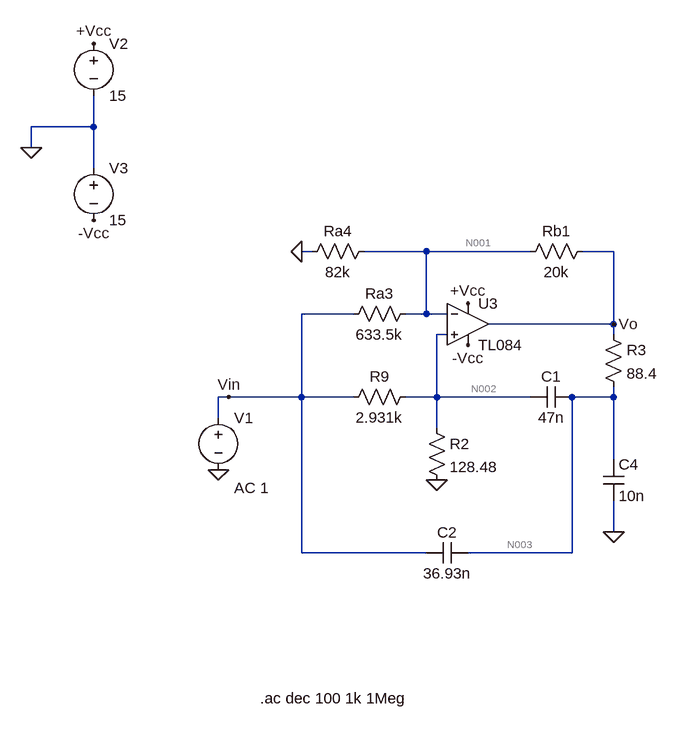
[diagram p0: schematic Sedra_etapa1.asc]
* Sedra_etapa1.asc
V1 Vin 0 AC 1
V2 +Vcc 0 15
V3 0 -Vcc 15
R9 N002 Vin 2.931k
Ra3 N001 Vin 633.5k
R2 N002 0 128.48
C1 N003 N002 47n
C2 N003 Vin 36.93n
Ra4 N001 0 82k
Rb1 Vo N001 20k
C4 N003 0 10n
R3 Vo N003 88.4
* U3: TL084 (symbol sympropio\TL084 not available, pins judged from their places): In+=N002 In-=N001 V+=+Vcc V-=-Vcc OUT=Vo
.ac dec 100 1k 1Meg
.backanno
.end

* Results of the author's LTspice run, read from the files saved beside the schematic
* Operating Point, zero values left out:
*   V(+vcc) = 15 V
*   V(-vcc) = -15 V
*   V(n001) = 10.97 µV
*   V(n003) = 14.89 µV
*   V(vo) = 14.89 µV
*   I(Rb1) = 196.1 pA
*   I(Ra4) = 133.7 pA
*   I(R2) = -43.16 pA
*   I(Ra3) = 17.31 pA
*   I(R9) = -1.892 pA
*   I(V3) = -14.19 mA
*   I(V2) = -14.19 mA
*   I(V1) = 15.42 pA
*   Ix(u3:1) = 45.05 pA
*   Ix(u3:2) = 45.05 pA
*   Ix(u3:3) = 14.19 mA
*   Ix(u3:4) = -14.19 mA
*   Ix(u3:5) = -196.1 pA
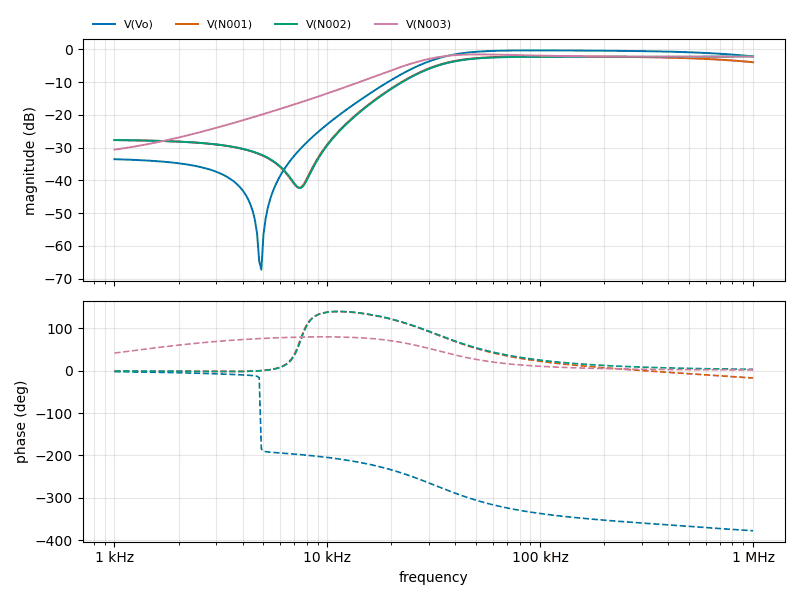
[diagram p1: AC Analysis of Sedra_etapa1.asc, plotted from the saved traces]
* AC Analysis, 1 run:
*   V(Vo): -33.53 dB at 1 kHz, -2.16 dB at 1 MHz, peak -0.33 dB at 95.5 kHz, 3 dB below the peak at 31.06 kHz
*   V(N001): -27.69 dB at 1 kHz, -3.94 dB at 1 MHz, peak -2.19 dB at 104.7 kHz, 3 dB below the peak at 31.89 kHz
*   V(N002): -27.69 dB at 1 kHz, -2.21 dB at 1 MHz, peak -2.21 dB at 1 MHz, 3 dB below the peak at 32.24 kHz
*   V(N003): -30.61 dB at 1 kHz, -2.20 dB at 1 MHz, peak -1.55 dB at 51.29 kHz, 3 dB below the peak at 24.23 kHz